# Altium schematic sheet ESD.SchDoc
size A3; SheetNumber: 1; SheetTotal: 1
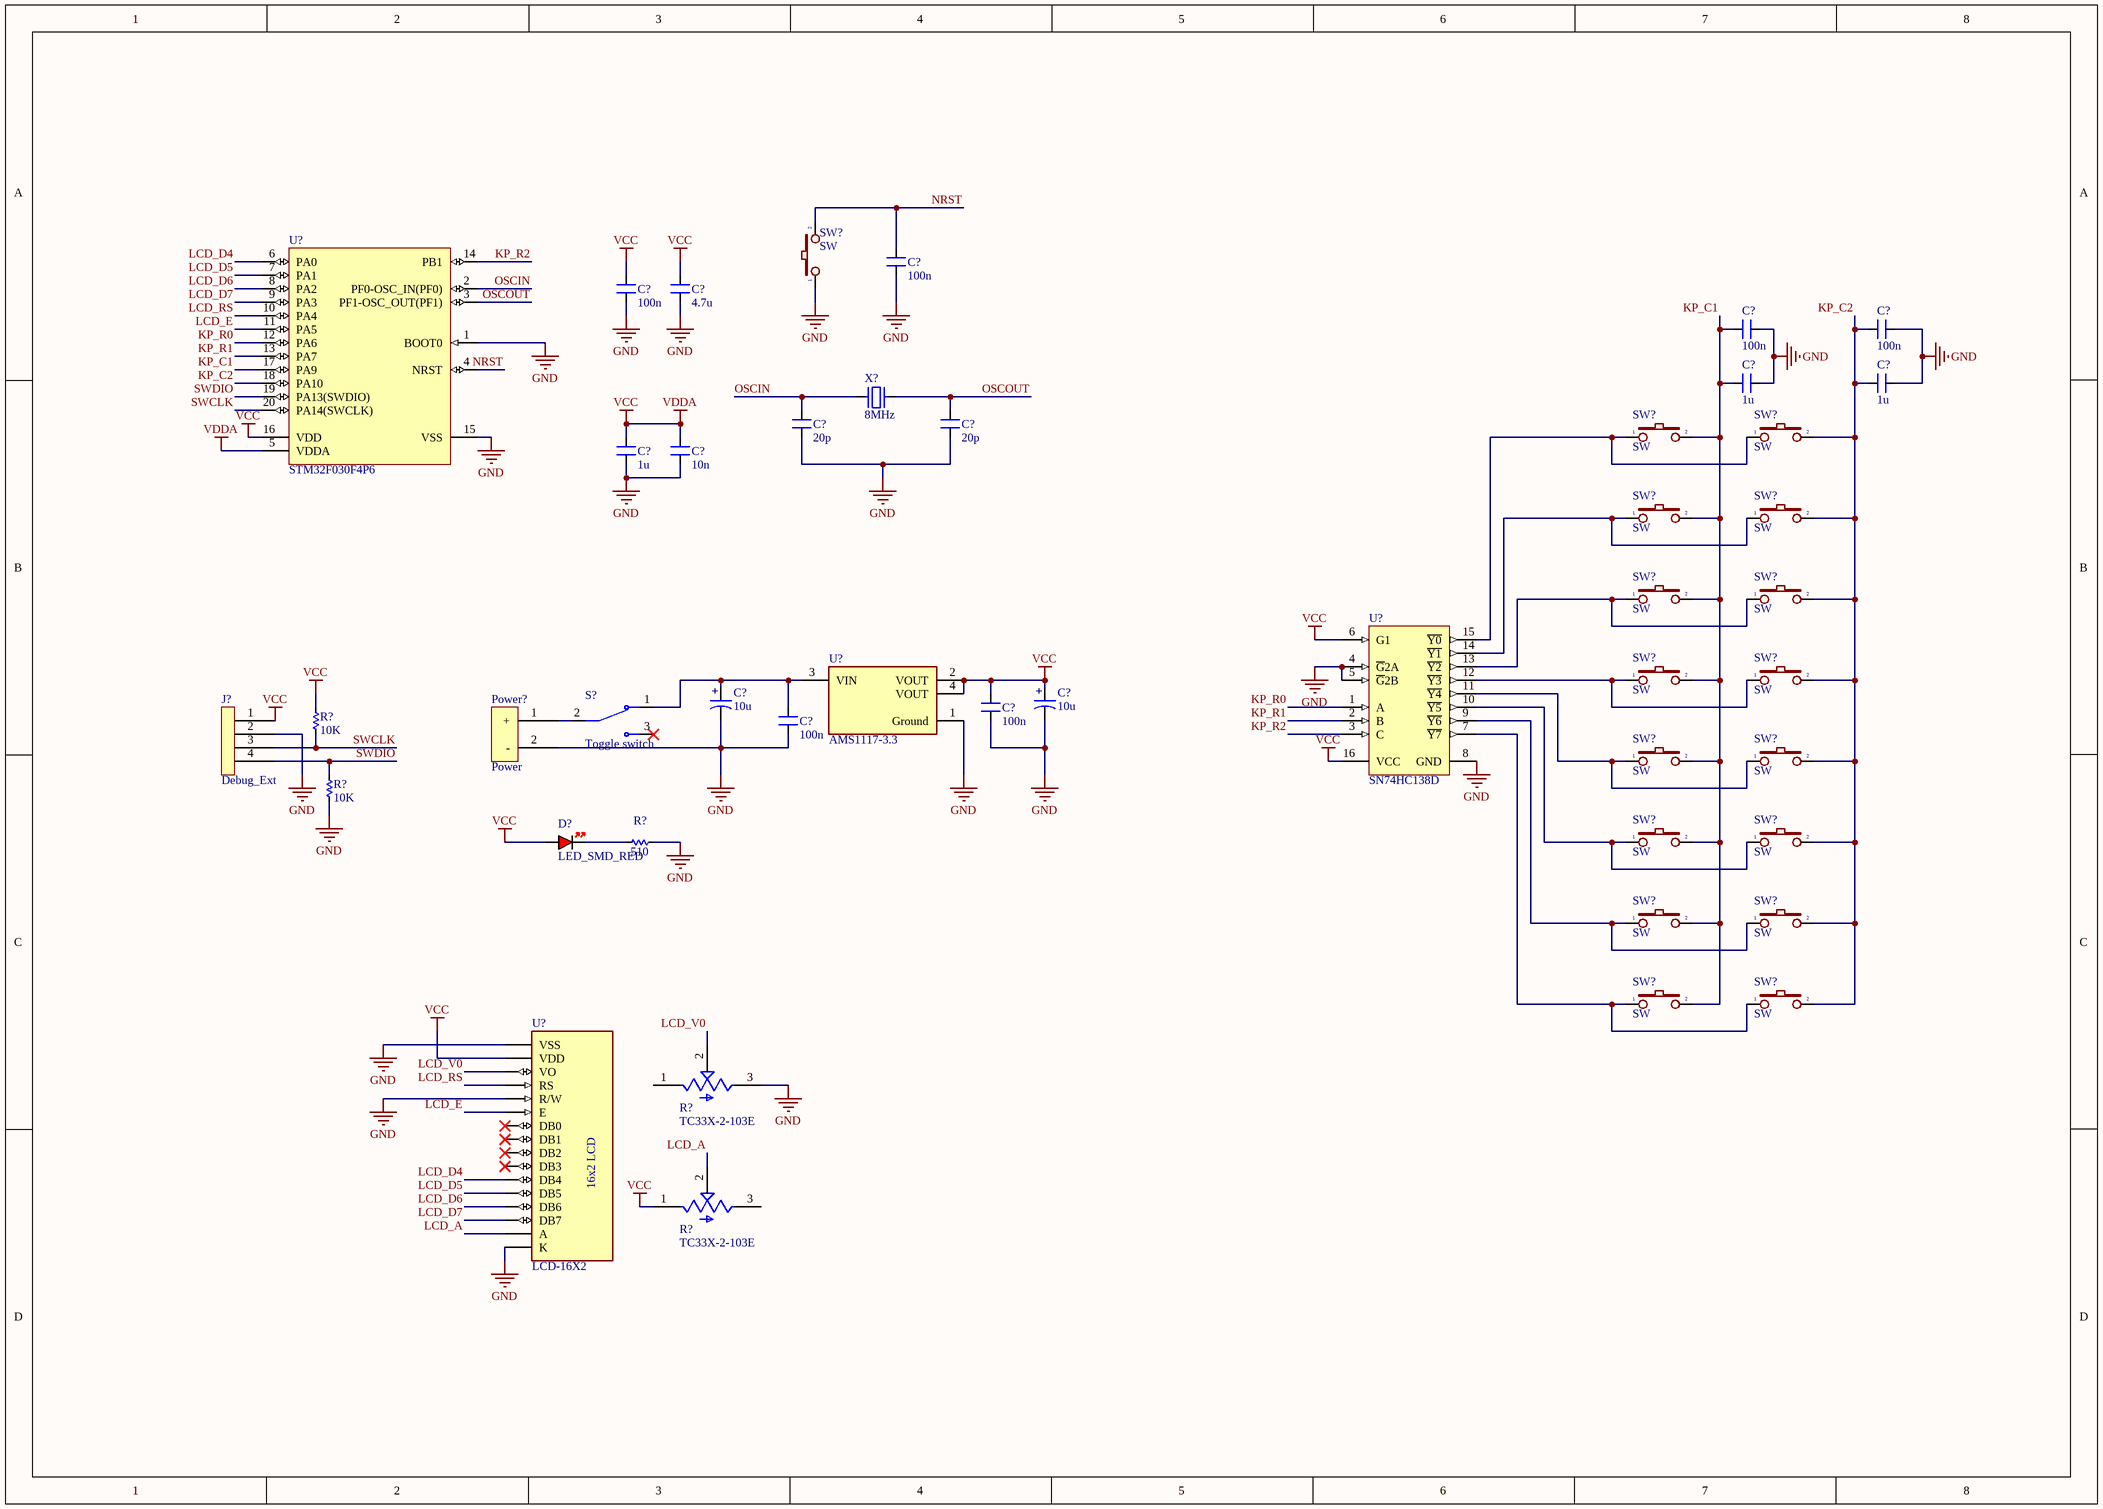
[diagram p0: ESD.SchDoc]

## Parts
(Parts that share a designator on the sheet are numbered #1, #2 ... from top to bottom, then left to right.)
C?#1  100n  [CAP_SMD_1206]
C?#2  100n  [CAP_SMD_1206]
C?#3  4.7u  [CAP_SMD_1206]
C?#4  100n  [CAP_SMD_1206]
C?#5  100n  [CAP_SMD_1206]
C?#6  1u  [CAP_SMD_1206]
C?#7  1u  [CAP_SMD_1206]
C?#8  20p  [CAP_SMD_1206]
C?#9  20p  [CAP_SMD_1206]
C?#10  1u  [CAP_SMD_1206]
C?#11  10n  [CAP_SMD_1206]
C?#12  10u  [CAP-ALU-SMD-5x5.5x1.4]
C?#13  10u  [CAP-ALU-SMD-5x5.5x1.4]
C?#14  100n  [CAP_SMD_1206]
C?#15  100n  [CAP_SMD_1206]
D?  LED_SMD_RED  [LED-1206-Red]
J?  Debug_Ext  [JP4-C1T]
Power?  Power  [JP2-C1T]
R?#1  10K  [RES_SMD_1206]
R?#2  10K  [RES_SMD_1206]
R?#3  510  [RES_SMD_1206]
R?#4  TC33X-2-103E  [TRIM_TC33X-2-103E]
R?#5  TC33X-2-103E  [TRIM_TC33X-2-103E]
S?  Toggle switch  [SW102T]
SW?#1  SW  [SW2-SMD-2.5mm]
SW?#2  SW  [SW1-DIP-12x12x8-Yellow]
SW?#3  SW  [SW1-DIP-12x12x8-Yellow]
SW?#4  SW  [SW1-DIP-12x12x8-Yellow]
SW?#5  SW  [SW1-DIP-12x12x8-Yellow]
SW?#6  SW  [SW1-DIP-12x12x8-Yellow]
SW?#7  SW  [SW1-DIP-12x12x8-Yellow]
SW?#8  SW  [SW1-DIP-12x12x8-Yellow]
SW?#9  SW  [SW1-DIP-12x12x8-Yellow]
SW?#10  SW  [SW1-DIP-12x12x8-Yellow]
SW?#11  SW  [SW1-DIP-12x12x8-Yellow]
SW?#12  SW  [SW1-DIP-12x12x8-Yellow]
SW?#13  SW  [SW1-DIP-12x12x8-Yellow]
SW?#14  SW  [SW1-DIP-12x12x8-Yellow]
SW?#15  SW  [SW1-DIP-12x12x8-Yellow]
SW?#16  SW  [SW1-DIP-12x12x8-Yellow]
SW?#17  SW  [SW1-DIP-12x12x8-Yellow]
U?#1  STM32F030F4P6  [STM-TSSOP20_L]
U?#2  SN74HC138D  [D0016A_N]
U?#3  AMS1117-3.3  [FP-AMS1117-IPC_A]
U?#4  LCD-16X2  [MODULE_LCD-16X2]
X?  8MHz  [XT2-SMD]

## Nets
GND: C?#1.1 C?#2.1 C?#3.1 C?#4.1 C?#5.1 C?#6.1 C?#7.1 C?#8.1 C?#9.1 C?#10.1 C?#11.1 C?#12.2 C?#13.2 C?#14.2 C?#15.2 J?.2 Power?.2(-) R?#2.2 R?#3.1 R?#4.3(CW) SW?#1.1 U?#1.1(BOOT0) U?#1.15(VSS) U?#2.4(~{G}2A) U?#2.5(~{G}2B) U?#2.8(GND) U?#3.1(Ground) U?#4.1(VSS) U?#4.5(R/W) U?#4.16(K)
VCC: C?#2.2 C?#3.2 C?#10.2 C?#11.2 C?#13.1 C?#14.1 D?.A J?.1 R?#1.1 R?#5.1(CCW) U?#1.5(VDDA) U?#1.16(VDD) U?#2.6(G1) U?#2.16(VCC) U?#3.2(VOUT) U?#3.4(VOUT) U?#4.2(VDD)  [also labelled VDDA]
KP_C1: C?#4.2 C?#6.2 SW?#2.2 SW?#4.2 SW?#6.2 SW?#8.2 SW?#10.2 SW?#12.2 SW?#14.2 SW?#16.2 U?#1.17(PA9)
KP_C2: C?#5.2 C?#7.2 SW?#3.2 SW?#5.2 SW?#7.2 SW?#9.2 SW?#11.2 SW?#13.2 SW?#15.2 SW?#17.2 U?#1.18(PA10)
KP_R0: U?#1.12(PA6) U?#2.1(A)
KP_R1: U?#1.13(PA7) U?#2.2(B)
KP_R2: U?#1.14(PB1) U?#2.3(C)
LCD_A: R?#5.2(W) U?#4.15(A)
LCD_D4: U?#1.6(PA0) U?#4.11(DB4)
LCD_D5: U?#1.7(PA1) U?#4.12(DB5)
LCD_D6: U?#1.8(PA2) U?#4.13(DB6)
LCD_D7: U?#1.9(PA3) U?#4.14(DB7)
LCD_E: U?#1.11(PA5) U?#4.6(E)
LCD_RS: U?#1.10(PA4) U?#4.4(RS)
LCD_V0: R?#4.2(W) U?#4.3(VO)
NRST: C?#1.2 SW?#1.2 U?#1.4(NRST)
OSCIN: C?#8.2 U?#1.2(PF0-OSC_IN(PF0)) X?.1
OSCOUT: C?#9.2 U?#1.3(PF1-OSC_OUT(PF1)) X?.2
SWCLK: J?.3 R?#1.2 U?#1.20(PA14(SWCLK))
SWDIO: J?.4 R?#2.1 U?#1.19(PA13(SWDIO))
NetC?#12_1: C?#12.1 C?#15.1 S?.1 U?#3.3(VIN)
NetD?_K: D?.K R?#3.2
NetPower?_1: Power?.1(+) S?.2
NetSW?#2_1: SW?#2.1 SW?#3.1 U?#2.15(~{Y0})
NetSW?#4_1: SW?#4.1 SW?#5.1 U?#2.14(~{Y1})
NetSW?#6_1: SW?#6.1 SW?#7.1 U?#2.13(~{Y2})
NetSW?#8_1: SW?#8.1 SW?#9.1 U?#2.12(~{Y3})
NetSW?#10_1: SW?#10.1 SW?#11.1 U?#2.11(~{Y4})
NetSW?#12_1: SW?#12.1 SW?#13.1 U?#2.10(~{Y5})
NetSW?#14_1: SW?#14.1 SW?#15.1 U?#2.9(~{Y6})
NetSW?#16_1: SW?#16.1 SW?#17.1 U?#2.7(~{Y7})

Not connected (* = marked no-connect by the designer): R?#4 1(CCW); R?#5 3(CW); S? 3*; U?#4 7(DB0)* 8(DB1)* 9(DB2)* 10(DB3)*

## Notes on the sheet
- (in symbol LCD-16X2) 16x2 LCD
- (in symbol pol_cap) +

## Library data of the parts
C?#1-C?#11 C?#14 C?#15 = CAP_SMD
C?#12 C?#13 = pol_cap
J? = Jumper4
R?#1-R?#3 = RES_SMD
R?#4 R?#5 = TC33X-2-103E: 10 kOhms 0.1W, 1/10W J Lead Surface Mount Trimmer Potentiometer Cermet 1 Turn Top Adjustment; MF: Bourns; MP: TC33X-2-103E; SnapEDA_Link: https://www.snapeda.com/parts/TC33X-2-103E/Bourns/view-part/47092/?ref=snap; Package: SOD-23 Bourns; Check_prices: https://www.snapeda.com/parts/TC33X-2-103E/Bourns/view-part/47092/?ref=eda; Value: *; Purchase-URL: https://pricing.snapeda.com/search/part/TC33X-2-103E/?ref=eda; Digi-Key_Part_Number: TC33X-103ECT-ND
S? = 100SP1T1B4M2QE: Toggle Switch SPDT Through Hole; Package: None; Price: None; Value: *; MP: 100SP1T1B4M2QE; Availability: Unavailable
SW?#1-SW?#17 = SW2: Switch button 2 pin; Value: SW chip 2 pin
U?#1 = CMP-0304-00039-2: ARM Cortex-M0 32-bit MCU, 16 KB Flash, 4 KB Internal RAM, 15 I/Os, 20-pin TSSOP, -40 to 85 degC, Tube; I/Os (High Current): 15; FLASH Size (Prog) (kB): 16; Internal RAM Size (kB): 4; Supply Voltage(Vcc) min (V): 2.4; Operating Frequency(F) (Processor speed) (MHz): 48; ComponentLink2URL: http://www.st.com/st-web-ui/static/active/en/resource/technical/document/datasheet/DM00088500.pdf; Core: ARM Cortex-M0; ComponentLink2Description: Datasheet; PackageDescription: 20-Pin Thin Shrink Small Outline Package, 6.5 x 4.4 mm Body, 0.65 mm Pitch; Mounting Technology: Surface Mount; ComponentLink1URL: http://www.st.com/web/en/home.html; PackageVersion: Rev. 1, 11/2012; ComponentLink3Description: Package Specification; PartNumber: STM32F030F4P6; ComponentLink3URL: http://www.st.com/st-web-ui/static/active/en/resource/technical/document/datasheet/DM00065136.pdf; DatasheetVersion: Rev. 1; PackageReference: TSSOP20; ComponentLink1Description: Manufacturer URL; Packing: Tube
U?#2 = CMP-1633-00243-2: 3-Line To 8-Line Decoders/Demultiplexers, D0016A, TUBE; Manufacturer: Texas Instruments; Technology Family: HC; Function: Decoder/Demultiplexer; VCC(Max)(V): 6; Output Drive (IOL/IOH)(Max)(mA): 5.2/-5.2; Voltage(Nom)(V): 3.3,5; VCC(Min)(V): 2; Input Type: LVTTL/CMOS; Rating: Catalog; ICC @ Nom Voltage(Max)(mA): 0.08; Configuration: 3：8; Bits(#): 8; Channels(#): 1; tpd @ Nom Voltage(Max)(ns): 45; F @ Nom Voltage(Max)(Mhz): 28; Schmitt Trigger: No; Output Type: CMOS; Type: Standard; Operating Temperature Range(C): -40 to 85; Generic Part Number: SN74HC138; Code_JEDEC: MS-012 variation AC; DatasheetVersion: SCLS107E; PackageReference: D0016A
U?#3 = CMP-209535-000001-1: LDO Voltage Regulators 1A, 3.3V; Manufacturer: Advanced Monolithic Systems; Dropout Voltage: 1.1V; Output Type: Fixed; Nominal Supply Current: 5mA; Max Power Dissipation: 1.2W; Max Supply Voltage: 15V; Number Of Outputs: 1; Standoff Height: 0.64mm; Max Junction Temp: +125°C; Height: 1.8mm; Package: AMS1117; Device Class L2: Power Management ICs; ComponentLink2Description: Datasheet; ComponentLink2URL: http://www.advanced-monolithic.com/pdf/ds1117.pdf; Category: IC; RoHS: TRUE; Automotive: No; Device Class L1: Integrated Circuits (ICs); Output Current: 1A; Device Class L3: Voltage Regulators - Linear; Temperature: -40°C to +125°C; Output Voltage: 3.3V; Manufacturer Part Number: AMS1117-3.3; Temperature Range Low: -40°C; Octopart: https://octopart.com/ams1117-3.3-advanced+monolithic+systems-25899300; Lead Free: Yes; Ipc Land Pattern Name: SOT229P700X180-4; Temperature Range High: +125°C
U?#4 = LCD-16X2: Display Development Tools 16x2 Black on Green Char LCD w Backlight; MF: Gravitech; Package: None; Price: None; Value: *; SnapEDA_Link: https://www.snapeda.com/parts/LCD-16X2/Gravitech/view-part/?ref=snap; MP: LCD-16X2; Availability: Not in stock; Check_prices: https://www.snapeda.com/parts/LCD-16X2/Gravitech/view-part/?ref=eda
X? = XT2: Crystal, 32.768 KHz, -40 to 85 degC, 3.2 x 1.5 x 0.9 mm SMD; Value: 4Mhz